# EAGLE board ferminator2000 (EAGLE 6.2)
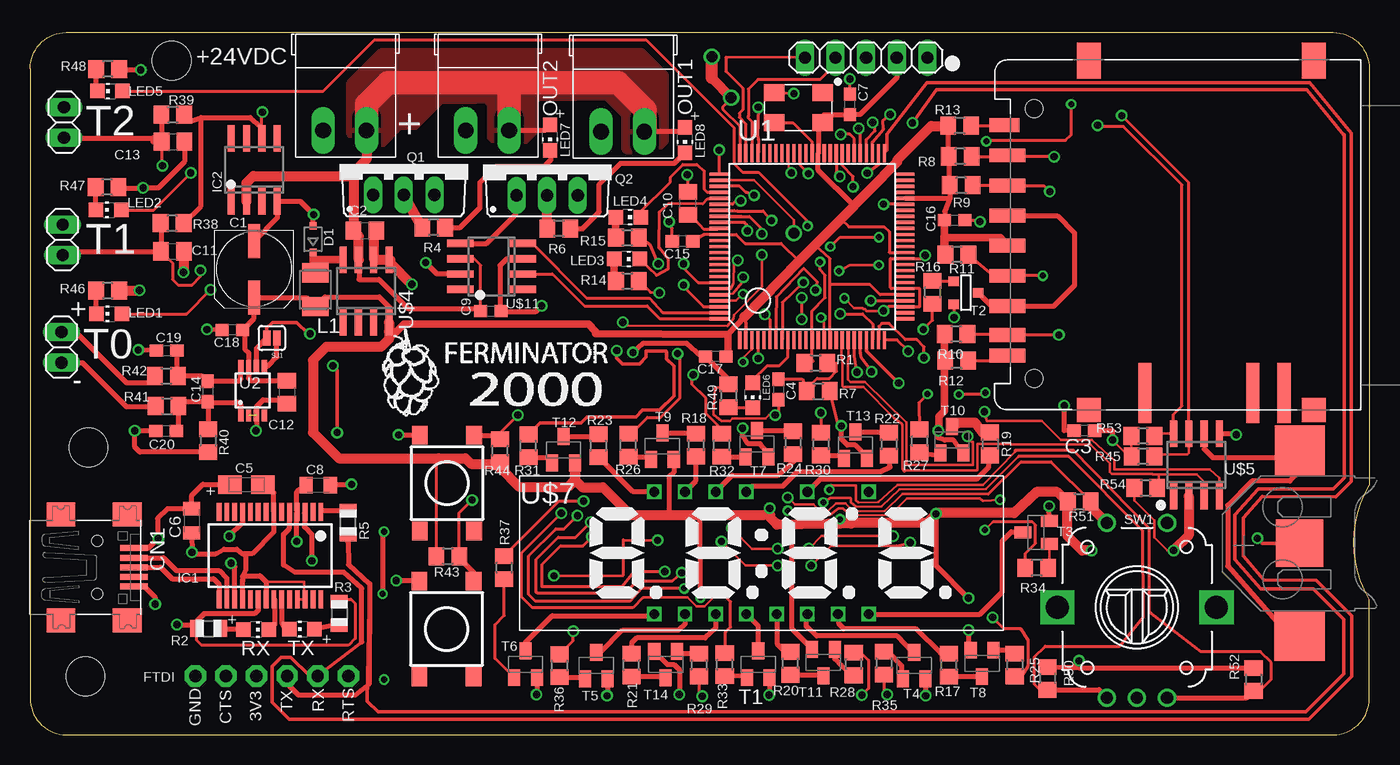
[diagram p4: board, top side]
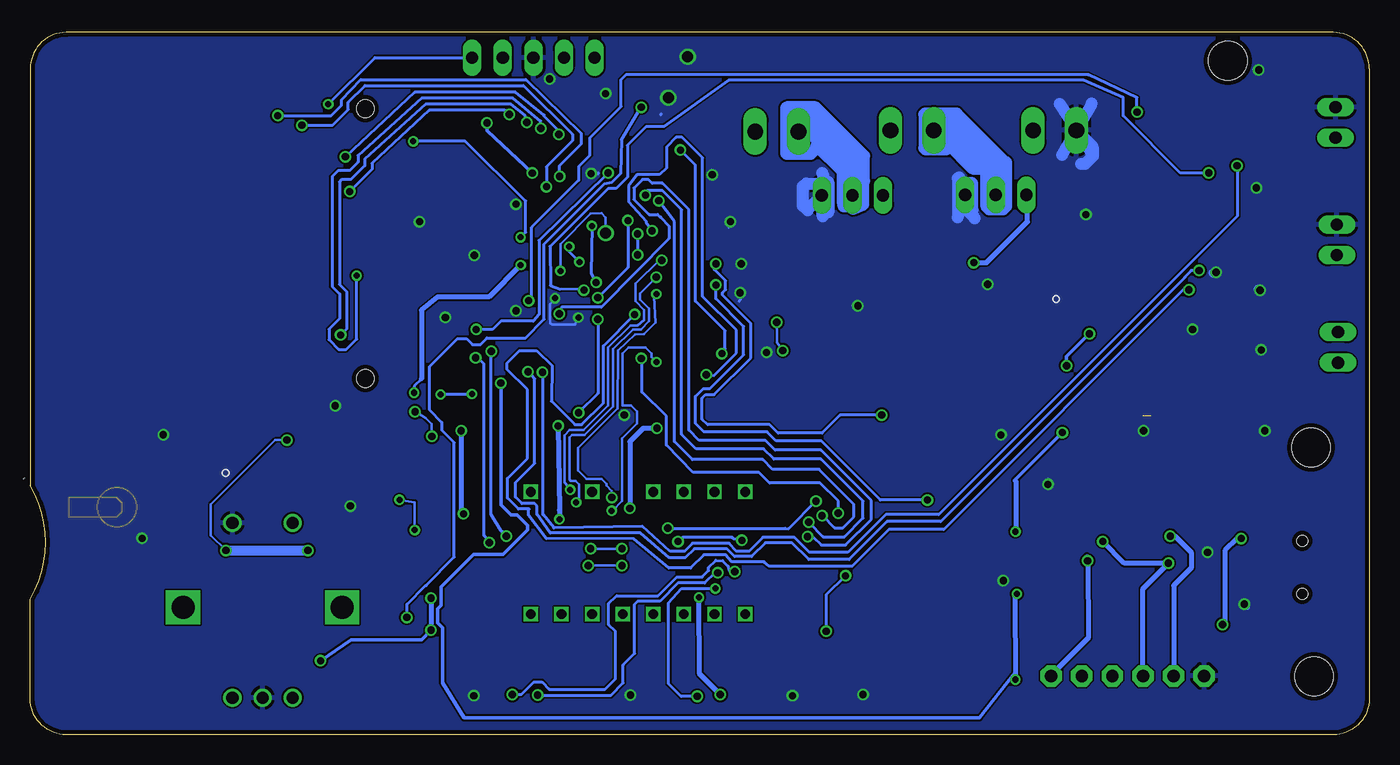
[diagram p5: board, bottom side, seen from below]

Size 111.15 x 58.3 mm. Coordinates in mm from the lower left corner, seen from the top.
Outline: 0,55.3 0,3 arc90 3,0 108.15,0 arc90 111.15,3 111.15,11.25 arc-61 111.15,20.7 111.15,55.3 arc90 108.15,58.3 3,58.3 arc90 0,55.3
Copper layers (1*16): Top 0.0356mm / dielectric 1.5011mm / Bottom 0.0356mm
Design rules: minimum track width 6mil, minimum drill 13mil, track to track 6mil, track to pad 6mil, pad to pad 6mil, via to via 6mil, smd to smd 6mil, copper to edge 15mil, drill to drill 6mil, minimum pad ring 7mil, minimum via ring 7mil, stop-mask expansion 4mil, vias tented up to drill 0mil, thermal gap 10mil
Holes 3.2 mm at 4.6,4.85 4.85,23.85 11.75,55.95

## Footprints (pad centres in the part's own frame; a part is rotated, then mirrored left to right if it is on the bottom)
UD-6,3X5,8_NICHICON = smd 2.8 x 1: + 2.35,0; - -2.35,0
C0805 = smd 1.3 x 1.5: 1 -0.95,0; 2 0.95,0
C0603 = smd 1.1 x 1: 1 -0.85,0; 2 0.85,0
A/3216-18R = smd 1.95 x 1.5: + 1.375,0; - -1.375,0
C0805K = smd 1.1 x 1.4: 1 -1,0; 2 1,0
USB-MINIB = smd 0.5 x 2.308: D+ 0,4.064; D- -0.8,4.064; GND 1.6,4.064; ID 0.8,4.064; VBUS -1.6,4.064 | smd 2 x 2.4: GND1 -4.4,-2; GND2 -4.4,3.5; GND3 4.4,3.5; GND4 4.4,-2 | hole 0.9: -2.2,1; 2.2,1
NEARLAB_DM1AA-SF-PEJ = smd 1.15 x 3: 1 6.225,14.25; 2 3.725,14.25; 3 1.225,14.25; 4 -1.275,14.25; 5 -3.775,14.25; 6 -6.275,14.25; 7 -8.7,14.25; 8 -10.4,14.25 | smd 1.15 x 2.5: 9 8.725,14.5 | smd 2 x 2: P$10 -14.9,7.5; P$12 -14.9,-11.15 | smd 3 x 2: P$11 14.1,7.5; P$13 14.1,-11.15 | smd 5 x 1.1: P$14 -13.5,2.85; P$15 -13.5,-6.1; P$16 -13.5,-8.7 | hole 1.45: 10.1,12.05; -12.3,12.05
1X05 = drill 1.016 long: 1 -5.08,0; 2 -2.54,0; 3 0,0; 4 2.54,0; 5 5.08,0
SOD323-R = smd 0.6 x 0.6: A 1.1,0; C -1.1,0
1X06-CLEANBIG = drill 1.016 pad 1.778 octagon: 1 -6.35,0; 2 -3.81,0; 3 -1.27,0; 4 1.27,0; 5 3.81,0; 6 6.35,0
SSOP28 = smd 0.4 x 1.5: 1 -4.225,-3.625; 2 -3.575,-3.625; 3 -2.925,-3.625; 4 -2.275,-3.625; 5 -1.625,-3.625; 6 -0.975,-3.625; 7 -0.325,-3.625; 8 0.325,-3.625; 9 0.975,-3.625; 10 1.625,-3.625; 11 2.275,-3.625; 12 2.925,-3.625; 13 3.575,-3.625; 14 4.225,-3.625; 15 4.225,3.625; 16 3.575,3.625; 17 2.925,3.625; 18 2.275,3.625; 19 1.625,3.625; 20 0.975,3.625; 21 0.325,3.625; 22 -0.325,3.625; 23 -0.975,3.625; 24 -1.625,3.625; 25 -2.275,3.625; 26 -2.925,3.625; 27 -3.575,3.625; 28 -4.225,3.625
SO08 = smd 0.6 x 2.2: 1 -1.905,-2.6; 2 -0.635,-2.6; 3 0.635,-2.6; 4 1.905,-2.6; 5 1.905,2.6; 6 0.635,2.6; 7 -0.635,2.6; 8 -1.905,2.6
L3225M = smd 1.6 x 2.2: 1 -1.4,0; 2 1.4,0
CHIP-LED0805 = smd 1.2 x 1.2: A 0,-1.05; C 0,1.05
TO220BV = drill 1.016 long: D 0,-2.54; G -2.54,-2.54; S 2.54,-2.54
R0805 = smd 1.3 x 1.5: 1 -0.95,0; 2 0.95,0
R0805' = smd 1.1 x 1.4: 1 -1,0; 2 1,0
TACTILE_SWITCH_TALL = smd 1.55 x 1.3: A1 -3.975,-2.25; A2 3.975,-2.25; B1 -3.975,2.25; B2 3.975,2.25
SJ_2S = smd 0.635 x 1.27: 1 -0.412,0; 2 0.412,0
PEC12_INCREMENTAL_ENCODER = drill 1: A -2.5,-7.5; B 2.5,-7.5; C 0,-7.5; P1 -2.5,7; P2 2.5,7 | drill 1.9 square: GND@1 -6.6,0; GND@2 6.6,0
SOT23-BEC = smd 1 x 1.4: B -0.95,-1.1; C 0,1.1; E 0.95,-1.1
SOT-23 = smd 0.787 x 0.889: 1 0.025,-1.016; 2 -0.94,1.016; 3 0.991,1.016
1X02 = drill 1.016 long: 1 -1.27,0; 2 1.27,0
TQFP100 = smd 0.27 x 1.5: 1 -6,-7.75; 2 -5.5,-7.75; 3 -5,-7.75; 4 -4.5,-7.75; 5 -4,-7.75; 6 -3.5,-7.75; 7 -3,-7.75; 8 -2.5,-7.75; 9 -2,-7.75; 10 -1.5,-7.75; 11 -1,-7.75; 12 -0.5,-7.75; 13 0,-7.75; 14 0.5,-7.75; 15 1,-7.75; 16 1.5,-7.75; 17 2,-7.75; 18 2.5,-7.75; 19 3,-7.75; 20 3.5,-7.75; 21 4,-7.75; 22 4.5,-7.75; 23 5,-7.75; 24 5.5,-7.75; 25 6,-7.75; 51 6,7.75; 52 5.5,7.75; 53 5,7.75; 54 4.5,7.75; 55 4,7.75; 56 3.5,7.75; 57 3,7.75; 58 2.5,7.75; 59 2,7.75; 60 1.5,7.75; 61 1,7.75; 62 0.5,7.75; 63 0,7.75; 64 -0.5,7.75; 65 -1,7.75; 66 -1.5,7.75; 67 -2,7.75; 68 -2.5,7.75; 69 -3,7.75; 70 -3.5,7.75; 71 -4,7.75; 72 -4.5,7.75; 73 -5,7.75; 74 -5.5,7.75; 75 -6,7.75 | smd 1.5 x 0.27: 26 7.75,-6; 27 7.75,-5.5; 28 7.75,-5; 29 7.75,-4.5; 30 7.75,-4; 31 7.75,-3.5; 32 7.75,-3; 33 7.75,-2.5; 34 7.75,-2; 35 7.75,-1.5; 36 7.75,-1; 37 7.75,-0.5; 38 7.75,0; 39 7.75,0.5; 40 7.75,1; 41 7.75,1.5; 42 7.75,2; 43 7.75,2.5; 44 7.75,3; 45 7.75,3.5; 46 7.75,4; 47 7.75,4.5; 48 7.75,5; 49 7.75,5.5; 50 7.75,6; 76 -7.75,6; 77 -7.75,5.5; 78 -7.75,5; 79 -7.75,4.5; 80 -7.75,4; 81 -7.75,3.5; 82 -7.75,3; 83 -7.75,2.5; 84 -7.75,2; 85 -7.75,1.5; 86 -7.75,1; 87 -7.75,0.5; 88 -7.75,0; 89 -7.75,-0.5; 90 -7.75,-1; 91 -7.75,-1.5; 92 -7.75,-2; 93 -7.75,-2.5; 94 -7.75,-3; 95 -7.75,-3.5; 96 -7.75,-4; 97 -7.75,-4.5; 98 -7.75,-5; 99 -7.75,-5.5; 100 -7.75,-6
MSOP8 = smd 0.45 x 1: 1 -0.975,-2.05; 2 -0.325,-2.05; 3 0.325,-2.05; 4 0.975,-2.05; 5 0.975,2.05; 6 0.325,2.05; 7 -0.325,2.05; 8 -0.975,2.05
CRYSTAL = smd 1.7 x 1.4: P$1 0.8,0.65; P$2 4.8,0.65; P$3 4.8,3.15; P$4 0.8,3.15
12.5MMCOILCELLHOLDER = smd 3.96 x 3.96: P$1 0,0 | smd 4.17 x 4.17: P$2 -7.69,0.02; P$3 7.66,0
PHOENIX_3.5MM = drill 1.3 long: P$1 0,0; P$2 0,3.6
SOIC8 = smd 0.6 x 2.2: 1 -1.905,-2.6; 2 -0.635,-2.6; 3 0.635,-2.6; 4 1.905,-2.6; 5 1.905,2.6; 6 0.635,2.6; 7 -0.635,2.6; 8 -1.905,2.6
LTC-4727JR = drill 0.8 square: 1 -8.89,-5.08; 2 -6.35,-5.08; 3 -3.81,-5.08; 4 -1.27,-5.08; 5 1.27,-5.08; 6 3.81,-5.08; 7 6.35,-5.08; 8 8.89,-5.08; 9 8.89,5.08; 11 3.81,5.08; 13 -1.27,5.08; 14 -3.81,5.08; 15 -6.35,5.08; 16 -8.89,5.08

## Placement (x,y rotation side)
C1  100u  [UD-6,3X5,8_NICHICON]  18.58,38.64 270 top
C2  1u  [C0805]  27.78,41.84 0 top
C3  .1u  [C0603]  87.5,25.24 180 top
C4  .1u  [C0603]  62.11,28.67 270 top
C5  10uF  [A/3216-18R]  17.96,20.76 180 top
C6  0.1uF  [C0805K]  13.41,17.76 270 top
C7  .1u  [C0603]  68.05,52.33 90 top
C8  0.1uF  [C0805K]  23.91,20.72 0 top
C9  .1u  [C0603]  38.24,35.17 0 top
C10  10uF  [C0805]  54.59,44.12 90 top
C11  10uF  [C0805]  11.81,40.13 0 top
C12  10u  [C0805]  21.31,28.44 270 top
C13  10uF  [C0805]  11.87,49.22 0 top
C14  10u  [C0603]  14.72,28.5 270 top
C15  .1u  [C0603]  54.14,40.96 180 top
C16  .1u  [C0603]  76.74,42.72 0 top
C17  .1u  [C0603]  56.9,31.41 180 top
C18  .1u  [C0603]  16.78,33.61 180 top
C19  10u  [C0603]  11.34,31.88 0 top
C20  10u  [C0603]  11.3,25.2 180 top
CN1  MINIB  [USB-MINIB]  4.56,13.9 270 top
CONN2  NEARLAB_SDCARD_HOLDER  [NEARLAB_DM1AA-SF-PEJ]  95.37,41.87 90 top
CPU  [1X05]  69.38,56.21 180 top
D1  [SOD323-R]  23.48,41.14 90 top
FTDI  [1X06-CLEANBIG]  20.06,4.88 0 top
IC1  FT232RL  [SSOP28]  19.91,14.88 180 top
IC2  REF01D  [SO08]  18.6,46.89 0 top
L1  [L3225M]  23.68,36.94 270 top
LED1  [CHIP-LED0805]  6.57,34.94 90 top
LED2  [CHIP-LED0805]  6.52,43.57 90 top
LED3  [CHIP-LED0805]  49.54,39.49 270 top
LED4  [CHIP-LED0805]  49.64,42.97 270 top
LED5  [CHIP-LED0805]  6.62,53.43 90 top
LED6  [CHIP-LED0805]  59.97,28.18 180 top
LED7  Red  [CHIP-LED0805]  43.15,49.56 180 top
LED8  Red  [CHIP-LED0805]  54.35,49.36 180 top
Q1  STP5NA50  [TO220BV]  31.01,47.35 0 top
Q2  STP5NA50  [TO220BV]  42.91,47.32 0 top
R1  470  [R0805]  65.21,30.86 0 top
R2  1k  [R0805']  14.82,8.82 0 top
R3  1k  [R0805']  25.66,10.08 270 top
R4  5.6k  [R0805]  33.49,42.11 180 top
R5  10  [R0805']  26.4,17.62 90 top
R6  5.6k  [R0805]  43.87,42.01 180 top
R7  10k  [R0805]  65.41,28.52 0 top
R8  10k  [R0805]  77.19,48.01 180 top
R9  10k  [R0805]  77.27,45.61 180 top
R10  10k  [R0805]  76.84,33.26 180 top
R11  10k  [R0805]  76.92,39.86 180 top
R12  10k  [R0805]  76.89,31.06 180 top
R13  10k  [R0805]  77.14,50.56 180 top
R14  1k  [R0805]  49.57,37.67 0 top
R15  1k  [R0805]  49.57,41.27 0 top
R16  22  [R0805]  74.9,36.73 90 top
R17  100  [R0805]  76.25,5.79 90 top
R18  100  [R0805]  55.26,24.05 270 top
R19  100  [R0805]  79.67,24.14 270 top
R20  100  [R0805]  63.1,5.93 90 top
R21  100  [R0805]  49.9,5.78 90 top
R22  100  [R0805]  71.27,24.11 270 top
R23  100  [R0805]  47.16,24 270 top
R24  100  [R0805]  63.31,24.25 270 top
R25  2.7k  [R0805]  81.71,5.8 270 top
R26  2.7k  [R0805]  49.65,24.03 90 top
R27  2.7k  [R0805]  73.82,24.39 90 top
R28  2.7k  [R0805]  68.35,5.88 90 top
R29  2.7k  [R0805]  55.51,5.8 270 top
R30  2.7k  [R0805]  65.65,24.13 90 top
R31  2.7k  [R0805]  41.35,23.98 90 top
R32  2.7k  [R0805]  57.4,24.03 90 top
R33  1k  [R0805]  57.65,5.83 90 top
R34  1k  [R0805]  83.54,13.86 180 top
R35  1k  [R0805]  70.86,5.95 270 top
R36  1k  [R0805]  43.95,5.73 90 top
R37  1k  [R0805]  39.35,13.88 90 top
R38  10k  [R0805]  11.79,42.46 180 top
R39  10k  [R0805]  11.84,51.46 180 top
R40  1MEG  [R0805]  14.77,24.41 270 top
R41  10k  [R0805]  11.37,27.28 0 top
R42  10k  [R0805]  11.32,29.78 0 top
R43  10k  [R0805]  34.67,14.82 0 top
R44  10k  [R0805]  39,23.58 90 top
R45  10k  [R0805]  92.36,23.11 180 top
R46  1k  [R0805]  6.44,36.86 180 top
R47  1k  [R0805]  6.39,45.46 180 top
R48  1k  [R0805]  6.44,55.26 180 top
R49  1k  [R0805]  57.96,28.15 270 top
R50  10k  [R0805]  84.42,4.68 270 top
R51  10k  [R0805]  87.07,19.37 0 top
R52  10k  [R0805]  101.54,4.59 270 top
R53  10k  [R0805]  92.35,24.81 180 top
R54  10k  [R0805]  92.59,20.48 180 top
RX  Green  [CHIP-LED0805]  18.77,8.73 270 top
S2  SWITCH-MOMENTARY-2  [TACTILE_SWITCH_TALL]  34.6,20.88 90 top
S3  SWITCH-MOMENTARY-2  [TACTILE_SWITCH_TALL]  34.56,8.78 90 top
SJ1  SOLDERJUMPERNC  [SJ_2S]  20.06,32.93 180 top
SW1  ENCODER_SW1-PEC12  [PEC12_INCREMENTAL_ENCODER]  91.86,10.58 0 top
T1  [SOT23-BEC]  60.43,5.85 0 top
T2  [SOT-23]  77.66,36.67 90 top
T3  [SOT23-BEC]  83.48,16.8 90 top
T4  [SOT23-BEC]  73.37,5.75 0 top
T5  [SOT23-BEC]  46.99,5.75 0 top
T6  [SOT23-BEC]  41.11,5.85 0 top
T7  [SOT23-BEC]  60.33,24.15 0 top
T8  [SOT23-BEC]  79.01,5.93 180 top
T9  [SOT23-BEC]  52.47,23.95 0 top
T10  [SOT23-BEC]  76.51,24.48 0 top
T11  [SOT23-BEC]  65.83,6 180 top
T12  [SOT23-BEC]  44.27,23.65 0 top
T13  [SOT23-BEC]  68.49,24.05 0 top
T14  [SOT23-BEC]  52.75,5.83 180 top
THERM0  [1X02]  2.6,32.16 270 top
THERM1  [1X02]  2.7,41.08 270 top
THERM2  [1X02]  2.8,50.83 270 top
TX  Red  [CHIP-LED0805]  22.55,8.77 90 top
U1  DSPIC33FJ256GP510A  [TQFP100]  64.9,40.53 0 top
U2  AD8495  [MSOP8]  18.46,28.57 0 top
U$1  FOX924  [CRYSTAL]  66.56,53.95 180 top
U$2  12MM_BATTER_HOLDER  [12.5MMCOILCELLHOLDER]  105.35,15.9 270 top
U$3  PHOENIX-3.5MM  [PHOENIX_3.5MM]  27.92,50.17 90 top
U$4  LM2594  [SOIC8]  27.88,36.84 0 top
U$5  DS3231  [SOIC8]  96.8,22.4 0 top
U$7  LTC-4027JRLTC-4027JR  [LTC-4727JR]  60.7,15.08 0 top
U$8  PHOENIX-3.5MM  [PHOENIX_3.5MM]  50.98,50.07 90 top
U$10  PHOENIX-3.5MM  [PHOENIX_3.5MM]  39.75,50.17 90 top
U$11  TC4427  [SOIC8]  38.31,38.88 90 top

## Tracks (layer width: path | path; a pad name or v marks a point on that pad's centre or on a via)
1
  Top 0.406: R17.1 T8.C
2
  Top 0.406: T9.C 55.26,25.05 R18.1
3
  Top 0.2: 79.09,25.05 R19.1
  Top 0.406: 79.56,25.15 R19.1
  Top 0.813: T10.C 77.11,25.91 78.43,25.91 79.09,25.05
4
  Top 0.406: R20.1 65.75,4.98 T11.C
5
  Top 0.406: R21.1 52.65,4.83 T14.C
6
  Top 0.406: T13.C 71.36,25.15 R22.1
7
  Top 0.406: T12.C 47.16,24.75 R23.1
8
  Top 0.406: T7.C 63.31,25.25 R24.1
+2.5VREF  (via drill 0.6)
  Top 0.254: IC2.6 19.23,51.65 v19.28,51.69 | v69.78,36.04 71.37,36.03 U1.29
  Top 0.406: R39.1 13.31,50.94 14.18,51.24 | 14.18,51.24 18.28,51.24 19.14,50.48 IC2.6 | R38.1 14.18,43.9 14.18,51.24
  Bottom 0.254: v19.28,51.69 19.28,52.89 23.33,54.79 61.7,54.79 62.1,54.39 62.1,52.15 64.7,49.55 64.7,48.1 65.63,47.17 65.63,46.04 69.53,42.14 69.53,36.29 v69.78,36.04
+3V3  (via drill 0.6)
  Top 0.406: IC1.17 16.98,13.93 v16.68,14.24 | v22.13,16.04 22.13,18.45 IC1.4 22.13,18.56 22.13,20.14 22.26,20.31 C8.1
  Bottom 0.406: v22.13,16.04 20.33,14.24 v16.68,14.24 18.79,12.13 FTDI.3
+5V  (via drill 0.6)
  Top 0.254: R3.1 25.82,11.24 26.63,11.24 26.98,10.89 26.98,7.99 26.43,7.44 14.23,7.44 13.82,7.85 R2.1
  Top 0.406: CN1.VBUS 9.84,15.5 v10.63,16.29 10.58,16.34 10.58,17.94 11.4,18.76 C6.1 13.41,19.87 14.33,20.79 16.55,20.79 C5.+ | v12.18,9.14 13.74,9.14 R2.1 13.82,9.43 14.43,10.04 18.63,10.04 18.93,10.34 IC1.20
  Bottom 0.406: v10.63,16.29 10.98,16.29 11.98,15.29 11.98,9.34 v12.18,9.14
+24V
  Top 0.254: C9.1 37.39,38.98 36.88,39.49 35.73,39.49 U$11.6
  Top 0.406: U$4.7 27.28,39.44 27.3,39.44 27.3,37.8 28.95,37.8 31.35,35.4 37.16,35.4 C9.1 | U$10.P$1 42.71,50.17 LED7.A | 51.03,50.12 54.06,50.12 LED8.A | 26.73,46.39 26.83,46.49
  Top 0.813: 27.28,39.44 27.28,41.39 C2.1 26.83,46.49 26.83,46.69 27.92,47.78 U$3.P$1 | IC2.2 17.96,45.83 18.53,46.39 26.73,46.39
  Top 1.93: U$3.P$1 27.92,52.33 29.73,54.14 39.73,54.14 | 39.73,54.14 48.78,54.14 51.03,51.89 51.03,50.12 U$8.P$1 | U$10.P$1 39.75,54.12 39.73,54.14
  pour Top: 26.4,51.12 26.4,49.92 27.36,48.96 29.3,48.96 30.76,50.42 32,50.42 34.16,52.58 36.94,52.58 36.98,52.62 37.81,52.62 38.1,52.33 38.1,49.55 39.02,48.63 40.51,48.63 41.92,50.04 41.92,52.54 42.21,52.83 45.24,52.83 45.28,52.87 47.81,52.87 49.26,51.42 49.26,51 49.26,48.63 49.47,48.42 51.96,48.42 52.83,49.29 52.83,54.74 50.8,56.77 29.09,56.77 26.4,54.08 26.4,51.29
AA1  (via drill 0.6)
  Top 0.254: R32.2 57.4,25.37 56.08,26.69 56.08,27.94 54.93,29.09 54.93,29.79 v55.03,29.89 | v59.53,41.84 59.53,42.29 59.29,42.53 U1.84
  Bottom 0.254: v55.03,29.89 54.38,29.84 52.53,31.69 52.53,33.59 55.33,36.39 55.33,47.89 57.03,49.59 57.53,49.59 58.33,48.79 58.33,47.04 58.93,46.51 60.78,46.51 61.48,45.54 61.47,44.25 60.03,42.64 60.03,42.54 v59.53,41.84
AA1_BASE
  Top 0.406: R32.1 59.38,23.08 T7.B
AB2  (via drill 0.6)
  Top 0.2: v60.73,39.84 60.73,37.19 58.43,34.84 58.38,34.54 57.88,33.94 49.63,33.99 49.43,33.99 v49.18,34.24 | 41.38,24.96 R31.2
  Top 0.254: 59.08,43.04 57.24,43.04 U1.83 59.69,43.03 60.73,41.99 v60.73,41.59
  Top 0.305: 41.38,24.96 42.31,25.89 45.73,25.89 46.23,26.39 50.28,26.39 50.83,26.94 52.23,26.94 53.43,28.14 53.43,30.59 52.83,31.19 52.83,31.79 52.78,31.84 51.13,31.84 51.13,31.34 50.58,30.79 49.18,30.79 48.68,31.29 v48.68,31.89
  Bottom 0.2: v49.18,34.24 49.18,32.54 v48.68,31.89
  Bottom 0.254: v60.73,41.59 v60.73,39.84
AB2_BASE
  Top 0.406: R31.1 43.32,23.03 T12.B
AC3  (via drill 0.6)
  Top 0.254: U1.82 58.44,43.53 58.68,43.49 60.83,43.49 v61.53,42.69 | v64.03,36.29 v64.03,34.49 | v65.63,26.74 65.63,25.1 R30.2
  Bottom 0.254: v61.53,42.69 61.53,38.79 v64.03,36.29 | v64.03,34.49 64.03,28.34 v65.63,26.74
AC3_BASE
  Top 0.406: R30.1 67.54,23.18 T13.B
AD  (via drill 0.5, 0.6)
  Top 0.254: R29.2 55.51,3.46 v55.78,3.19 | v54.28,12.14 50.73,12.14 49.78,11.09 41.93,11.09 41.38,11.64 41.38,14.84 43.63,17.09 44.33,17.09 v45.43,18.19 | v58.98,44.34 58.59,44.34 58.3,44.05 U1.81
  Bottom 0.254: v55.78,3.19 57.13,3.19 58.18,4.24 58.18,10.94 57.08,12.14 v54.28,12.14 | v45.43,18.19 45.38,18.19 44.38,17.19 43.68,17.19 42.78,18.09 42.78,19.14 45.68,22.04 49.53,22.04 50.33,22.84 56.18,22.84 57.68,24.34 57.68,42.59 v58.98,44.34
AD_BASE
  Top 0.406: T14.B 53.88,6.75 R29.1
ADP  (via drill 0.6)
  Top 0.254: R25.2 82.29,4.85 82.83,5.74 82.83,7.84 82.23,8.79 80.83,8.79 v79.88,9.74 | v60.43,52.09 60.36,49.69 60.43,49.39 60.43,48.31 U1.72
  Bottom 0.254: v79.88,9.74 79.88,10.84 78.33,12.39 78.28,12.39 75.96,14.75 75.96,24.25 76.98,25.29 76.98,25.94 78.03,26.99 78.03,30.54 75.68,32.89 74.93,32.89 74.43,32.39 73.78,32.39 73.23,32.94 70.03,32.94 68.48,34.49 68.48,40.74 63.53,45.69 62.88,45.84 62.13,46.59 62.08,49.39 v60.43,52.09
ADP_BASE
  Top 0.406: T8.B 81.43,7.03 R25.1
AE  (via drill 0.6)
  Top 0.254: R28.2 68.45,6.86 68.48,6.89 68.88,6.89 69.58,6.19 69.58,3.84 v69.03,3.29 | v54.08,13.44 53.28,12.74 50.28,12.74 49.48,11.74 42.08,11.74 41.98,11.84 41.98,14.54 43.83,16.39 45.28,16.39 v46.53,17.64 | v60.08,44.79 59.38,45.04 58.88,45.54 U1.78
  Bottom 0.254: v69.03,3.29 62.93,3.29 61.93,4.29 61.93,5.79 60.98,6.74 60.98,10.84 60.73,11.09 58.88,11.09 57.38,12.59 55.18,12.59 54.33,13.44 v54.08,13.44 | v46.53,17.64 45.33,16.44 43.58,16.44 42.03,17.99 42.03,19.39 45.53,22.89 49.43,22.89 50.28,23.74 55.88,23.74 57.08,24.94 57.08,43.59 58.68,45.19 59.93,45.19 v60.08,44.79
AE_BASE
  Top 0.406: T11.B 66.78,6.29 67.38,5.69 R28.1
AF  (via drill 0.5, 0.9)
  Top 0.2: U1.77 60.08,46.04 63.38,42.74 v63.38,41.64 | v67.14,38.51 68.03,38.99 v70.43,38.99
  Top 0.254: v79.28,28.39 79.13,28.24 v77.08,28.24 | v74.48,28.29 73.75,27.56 R27.2
  Bottom 0.2: v63.38,41.64 63.38,42.94 63.73,43.29 64.65,43.27 67.14,40.75 v67.14,38.51 | v70.43,38.99 70.38,39.04
  Bottom 0.254: 78.68,29.54 79.28,28.94 v79.28,28.39 | v77.08,28.24 77.03,28.29 v74.48,28.29
  Bottom 0.406: 70.33,39.09 v70.43,38.99 73.08,36.34 77.33,36.34 78.68,35.24 78.68,29.54
AF_BASE
  Top 0.406: R27.1 75.6,23.13 T10.B
AG  (via drill 0.6)
  Top 0.254: R26.2 49.87,24.98 51.23,26.34 52.33,26.34 53.93,27.94 53.93,31.29 v53.73,31.64 | v57.18,48.54 57.18,46.56 U1.76
  Bottom 0.254: v53.73,31.64 53.73,31.79 53.48,32.04 53.48,33.54 55.93,35.99 55.93,47.29 v57.18,48.54
AG_BASE
  Top 0.406: R26.1 51.52,23.08 T9.B
CLKIN
  Top 0.254: U$1.P$3 63.32,50.8 64.88,49.24 64.88,48.3 U1.63
CS1  (via drill 0.6)
  Top 0.254: R8.1 81.03,48.01 CONN2.1 81.22,47.99 v84.98,47.99 | U1.56 68.4,49.47 68.03,49.84 v67.28,49.84
  Bottom 0.254: v67.28,49.84 67.28,50.14 68.48,51.34 68.48,51.44 70.88,53.34 79.23,53.34 v84.98,47.99
CTS  (via drill 0.6)
  Top 0.406: IC1.11 17.64,17.59 v16.53,16.49
  Bottom 0.406: v16.53,16.49 16.13,16.49 14.78,15.14 14.78,13.84 16.23,12.39 16.23,4.9 FTDI.2
GATE
  Top 0.254: R16.2 74.92,37.66 T2.3
GND  (via drill 0.5, 0.6, 0.9)  (1 unrouted)
  Top 0.2: R49.1 57.7,28.84 56.83,28.84 56.73,26.59 57.38,26.04 58.08,26.04 58.28,26.24 61.03,26.24 61.33,26.54 v61.83,26.54 | U1.15 65.88,32.8 65.88,34.24 65.53,34.64 v65.65,34.64 | v67.58,36.24 68.38,35.44 69.08,35.44 69.18,35.34 69.28,35.34 69.43,35.19 v70.83,35.19 | IC1.25 IC1.26 22.73,11.36 22.73,12.69 19.58,12.69
  Top 0.254: C15.2 53.29,42.03 v53.03,42.59 | C10.2 54.59,46.58 v54.53,46.49 | U1.65 63.9,47.27 v64.59,46.59 | C7.2 68.05,53.27 v68.03,54.44 | R15.2 51.4,40.72 v52.13,39.09 | C4.2 62.11,26.82 v61.83,26.54 | U1.45 v70.84,44.03 v70.83,44.04 | C16.2 78.5,42.72 v78.83,42.59 | v70.83,35.19 70.88,35.19 71.23,35.54 U1.28 73.83,35.54 73.83,37.04 73.82,37.03 U1.31 71.48,37.04 71.38,37.14 71.38,39.49 71.42,39.53 U1.36 74.08,39.54 74.28,39.74 v74.28,39.79 | T2.2 76.68,35.69 v76.68,34.64 | 61.72,53.34 U$1.P$2 v63.39,53.22 | R14.2 50.66,37.57 51.48,36.74 52.18,36.64 v52.23,36.69 | R49.1 57.96,29.5 | C17.2 55.66,31.41 | 58.93,48.31 U1.75 58.91,50.51 57.47,51.95 57.47,52.11 58.23,52.87 58.23,52.89 v58.18,52.89 | C9.2 39.09,38.85 39.68,39.44 40.83,39.44 U$11.3
  Top 0.305: U$2.P$1 102.25,15.9 v101.85,16.3
  Top 0.406: 28.52,41.62 C2.2 | C20.2 8.72,25.2 v8.68,25.24 8.68,23.89 9.11,23.46 R40.2 | C19.1 v8.98,31.94 | C18.2 v14.68,33.64 | R48.1 7.46,55.19 v9.18,55.19 | R47.1 7.34,45.39 v9.38,45.39 10.63,45.39 12.82,47.58 C13.2 | C12.2 21.01,27.79 19.33,27.79 18.79,27.25 U2.3 18.79,25.29 v18.73,25.24 | C6.2 13.46,15.02 | CN1.GND 9.47,12.3 10.38,11.39 v10.38,10.84 | 13.53,15.24 13.46,15.02 | 13.46,15.02 v13.43,15.14 | 13.46,15.02 15.41,15.02 16.08,15.39 17.18,15.39 17.64,15.03 | 17.64,15.03 17.88,14.84 17.88,13.64 17.63,13.14 17.63,12.74 | IC1.18 17.63,11.31 17.63,12.74 | 17.64,15.03 18.42,15.03 20.23,16.84 IC1.7 20.23,20.09 19.68,20.64 | 19.68,20.64 19.56,20.76 C5.- | 19.68,20.64 19.53,20.64 19.43,20.74 19.18,20.74 19.23,20.79 19.33,20.79 | C8.2 24.63,20.79 v26.68,20.79 | 17.63,12.74 17.68,13.19 19.08,13.19 19.58,12.69 19.58,11.31 IC1.21 | S2.B2 30.61,24.86 v30.58,24.89 | S3.B2 30.42,12.75 v30.38,12.79 | T6.E 42.06,3.12 v42.03,3.34 | T5.E 47.94,3.55 v47.88,3.24 | T1.E 61.38,3.49 v61.33,3.29 | T4.E 74.32,3.35 v74.33,3.24 | T3.E v84.57,18.98 v84.58,18.99 | U$4.5 29.88,39.44 | D1.A 23.48,43.14 v23.53,43.19 22.43,44.29 IC2.4 20.5,42.92 C1.- | 57.96,29.5 C17.2 | 55.66,31.41 54.48,32.49 50.88,32.49 v50.03,31.74 | U$11.3 39.61,39.52 39.6,39.5 39.55,39.5 39,38.95 39,35.15 42,35.15 v42.45,35.6 | U$5.5 100,25 v100.1,24.9 | C3.2 85.83,25.24 v85.83,27.32 | U$4.6 28.52,39.51 28.58,39.44 U$4.6
  Top 0.813: 28.58,39.44 U$4.5 | 28.52,41.62 28.52,39.51 | 29.88,39.44 29.88,39.19 v31.68,37.39 | C11.2 12.76,38.42 v12.73,38.39 | R46.1 9.05,36.86 v9.08,36.89 | 56.58,54.54 56.58,54.49 v58.18,52.89
  Top 1.016: 56.58,54.54 v56.58,56.29
  Bottom 0.2: v65.65,34.64 65.93,34.04 67.83,34.04 67.98,34.19 67.98,35.74 67.58,36.14 v67.58,36.24 | v56.58,56.29 56.78,56.29
  Bottom 0.254: v53.03,42.59 53.18,42.14 | v54.53,46.49 54.68,46.84 54.63,46.89 | 58.78,51.54 58.83,51.49 58.83,51.44 | v64.59,46.59 63.98,46.59 64,46.64 | v68.03,54.44 68.08,54.64 | v52.13,39.09 52.23,38.99 | 52.28,35.99 52.28,36.04 52.18,36.14 52.23,36.19 v52.23,36.69 | v61.83,26.54 61.58,26.29 | v70.83,44.04 70.78,44.04 70.68,43.94 | v78.83,42.59 78.98,42.44 | v70.83,35.19 70.73,35.19 | v74.28,39.79 74.18,39.79 | v76.68,34.64 76.63,34.69 76.58,34.69 | v50.03,31.74 49.88,31.59 | v58.18,52.89 58.28,52.99 58.38,52.99
  Bottom 0.305: v101.85,16.3 101.85,16.45 101.8,16.5
  Bottom 0.406: v8.68,25.24 8.48,25.34 | v8.98,31.94 8.78,31.94 | v14.68,33.64 14.68,33.84 | v9.18,55.19 9.23,55.24 9.53,55.24 | v9.38,45.39 9.38,45.69 9.33,45.69 | v18.73,25.24 18.88,25.24 18.93,25.19 | v13.43,15.14 13.13,15.14 | v10.38,10.84 10.38,10.79 10.13,10.54 | v26.68,20.79 26.68,21.14 | v30.58,24.89 30.38,25.09 | v30.38,12.79 30.38,12.99 30.43,13.04 | v42.03,3.34 41.88,3.39 | v61.33,3.29 61.13,3.44 | v74.33,3.24 74.18,3.34 | v84.58,18.99 84.63,18.99 84.68,19.04 | v31.68,37.39 31.68,37.69 | v23.53,43.19 23.73,43.19 23.78,43.24 | v42.45,35.6 42.8,35.6 | v100.1,24.9 100.1,24.85 100.25,24.7 | v85.83,27.32 85.54,27.32 85.54,27.21
  Bottom 0.813: v12.73,38.39 12.88,38.39 12.93,38.34 | v9.08,36.89 9.18,36.99
  Bottom 1.016: 32.74,42.87 34.06,44.19 34.06,46.29 34.17,46.18 34.17,42.97 | 32.93,43.58 32.96,43.61 32.96,45.77 33,45.81 33.52,45.81 33.52,45.27 | 45.41,46.64 45.35,46.58 45.35,43.41 | 45.35,43.41 45.35,43.04 45.38,43.07 45.38,44.83 46.63,43.58 46.63,43.54 47.01,43.92 47.01,45.52 46.76,45.77 45.47,45.77 45.47,44.86 | 45.02,45.91 44.91,45.89 44.91,43.35 44.97,43.41 45.35,43.41 | 23.05,52.39 25.52,48.15 | 25.69,52.35 22.92,48.06 23.61,47.37 23.91,47.37 | U$3.P$2 22.96,48.81 22.96,48.02 23.05,47.93
  pour Bottom: 110.98,58.24 -0.02,58.24 -0.02,0.24 110.98,0.24
HEATER1
  Top 0.2: U1.99 57.05,35.03 57.03,35.05
  Top 0.254: 57.03,35.05 52.5,35.05 51.4,36.25 46.2,36.25 41.65,40.8 40.92,40.8 U$11.4
HEATER2
  Top 0.2: U1.100 57.13,34.55
  Top 0.254: U$11.2 43.35,38.25 46,35.6 51.2,35.6 52.25,34.55 57.13,34.55
K1  (via drill 0.6)
  Top 0.2: v58.23,17.14 59.93,15.44 v62.03,15.44 | v64.63,15.44 65.68,16.49 v71.63,16.49
  Top 0.254: R37.2 43.91,19.39 v45.93,19.39 | v72.88,31.84 71.94,32.78 U1.25
  Bottom 0.2: v62.03,15.44 v64.63,15.44
  Bottom 0.254: v45.93,19.39 48.23,17.09 48.48,17.14 v58.23,17.14 | v72.88,31.84 72.88,18.29 72.08,16.94 71.63,16.69 v71.63,16.49
K2  (via drill 0.6)
  Top 0.2: v57.38,16.04 59.38,14.04 v62.03,14.04 | v64.83,14.04 66.48,15.69 71.93,15.69
  Top 0.254: R36.2 45.08,7.81 v45.08,8.59 | v74.18,31.29 74.18,32.19 73.58,32.79 72.63,32.79 71.28,34.14 70.68,34.14 70.43,33.89 70.43,32.81 U1.24 | v43.48,13.19 49.23,13.24 49.23,16.19 v52.08,16.14 | 71.93,15.69 v73.03,15.94
  Bottom 0.2: v62.03,14.04 v64.83,14.04
  Bottom 0.254: v74.18,31.29 73.98,31.29 73.48,30.79 73.48,16.54 v73.03,15.94 | v45.08,8.59 45.08,11.64 v43.48,13.19 | v52.08,16.14 52.73,16.24 52.88,16.39 56.98,16.39 v57.38,16.04
K3  (via drill 0.6)
  Top 0.254: R35.2 70.86,3.61 v71.13,3.34 | v52.68,13.54 50.13,13.54 49.13,12.29 42.48,12.29 42.48,14.14 44.03,15.69 45.88,15.69 v46.63,16.44 | v67.23,34.94 69.08,34.94 69.93,34.09 69.93,32.81 U1.23
  Bottom 0.254: v71.13,3.34 70.38,3.34 69.33,4.39 68.68,4.39 68.08,3.79 63.43,3.79 62.58,4.64 62.58,8.59 63.13,9.14 63.13,10.89 62.48,11.54 59.03,11.54 57.48,13.09 55.38,13.09 54.83,13.64 54.83,13.89 54.23,14.49 53.68,14.44 53.23,13.99 53.13,13.64 v52.68,13.54 | v46.63,16.44 46.18,16.44 45.48,15.74 43.48,15.74 41.33,17.89 41.33,19.44 45.53,23.64 49.33,23.64 50.13,24.44 55.63,24.44 56.48,25.29 56.48,43.59 58.68,45.79 59.53,45.79 59.83,46.09 60.33,46.09 61.03,45.39 61.03,44.44 59.78,43.19 59.08,43.19 58.88,42.99 58.83,42.99 58.13,42.24 58.13,41.19 63.74,35.49 67.03,35.49 v67.23,34.94
K3_BASE
  Top 0.406: R35.1 71.22,6.85 72.33,5.74 72.33,4.74 T4.B
K4  (via drill 0.5)
  Top 0.18: 68.07,18.24 71.38,18.25
  Top 0.2: U1.3 59.88,32.76 59.88,31.99 59.18,31.29 v59.18,30.94 | v62.88,18.59 63.33,18.19 66.38,18.24 67.08,18.79 67.48,18.79 68.07,18.24 | 71.38,18.25 72.78,19.61 78.83,19.61 79.08,19.39 v80.5,19.51 | v79.23,16.99 79.88,17.64
  Top 0.254: R34.2 82.59,15.04 83.45,15.9 83.45,17.4 83.2,17.65 79.89,17.65 79.88,17.64
  Bottom 0.2: v59.18,30.94 59.58,31.34 59.58,31.64 60.08,32.14 61.48,32.14 61.98,31.64 61.98,27.34 61.28,27.34 60.78,26.84 60.78,25.84 62.03,24.59 62.03,19.39 62.83,18.59 v62.88,18.59 | v80.5,19.51 79.23,19.29 v79.23,16.99
K4_BASE
  Top 0.2: T3.B 84.58,13.95 R34.1
  Top 0.406: 84.54,15.93 T3.B
K5  (via drill 0.6)
  Top 0.2: 50.88,11.39 54.56,11.39 55.3,10.65 55.95,10.65 56.7,11.4 57.77,11.4
  Top 0.254: R33.2 57.73,6.69 57.73,8.54 58.13,8.94 58.13,11.04 57.77,11.4 | 50.88,11.39 50.03,10.54 41.68,10.54 40.78,11.44 40.78,15.09 v44.08,18.39 | v60.43,31.24 60.43,32.75 U1.4
  Bottom 0.254: v44.08,18.39 44.08,19.39 45.58,20.89 49.78,20.89 50.68,21.79 56.13,21.79 58.35,24.05 58.35,26.45 60.38,28.44 60.38,31.19 v60.43,31.24
K5_BASE
  Top 0.406: R33.1 59.3,4.93 T1.B
MCLR1  (via drill 0.5)
  Top 0.254: R1.1 65.01,31.01 64.88,31.14 64.88,32.76 U1.13 64.9,35.18 65.97,36.29 65.97,38.16 65.57,38.6 v65.57,39.25 | v66.41,40.52 67.22,41.3 v70.45,41.3 | v79.35,49.26 79.43,49.34 85.93,49.34 86.4,49.81 v86.4,52.34
  Bottom 0.254: v65.57,39.25 66.58,40.26 v66.41,40.52 | v70.45,41.3 70.03,41.72 70.03,44.32 75.04,49.26 v79.35,49.26 | v86.4,52.34 82.53,56.21 CPU.1
N$1
  Top 0.254: R13.1 80.83,50.56 CONN2.9
N$2
  Top 0.254: R12.1 80.71,31.06 CONN2.8
N$3
  Top 0.61: LED3.A 48.44,37.55 R14.1
N$5
  Top 0.61: R15.1 48.57,41.69 LED4.A
N$6
  Top 0.254: R1.2 66.93,30.8 66.93,30.19 66.33,29.59 65.32,29.59 64.72,28.99 65.08,28.99 R7.1 64.08,29.52 C4.1
N$7
  Top 0.406: CN1.D+ 10.82,13.9 11.78,12.94 15.23,12.94 15.68,12.49 IC1.15
N$8
  Top 0.406: 82.43,35.59 81.95,35.59 | 81.95,35.59 CONN2.6 | CONN2.6 | CONN2.6 79.78,35.59 T2.1 | CONN2.3 85.23,43.1 86.68,41.65 86.68,37.3 84.94,35.56 81.98,35.56 81.95,35.59
N$9
  Top 0.406: CN1.D- 11.07,14.7 12.13,13.64 15.68,13.64 16.33,12.99 IC1.16
N$10
  Top 0.254: C10.1 54.79,43.18 55.88,41.99 57.09,41.99 U1.85
N$11
  Top 0.406: IC1.23 20.89,10.33 20.88,9.29 21.38,8.34 TX.C
N$12
  Top 0.254: LED4.C 50.59,43.35 53.13,45.89 53.13,46.29 54.18,47.34 55.33,47.34 55.93,46.79 55.93,45.29 56.18,45.04 U1.79
N$13
  Top 0.406: IC1.22 20.28,11.25 20.28,9.09 RX.C
N$14
  Top 0.406: RX.A 15.58,8.73 R2.2
N$15
  Top 0.2: 52.98,44.09 55.83,44.09
  Top 0.254: LED3.C 51.98,38.14 52.98,38.69 52.98,39.44 52.18,40.44 52.23,43.39 52.98,44.09 | 55.83,44.09 56.23,44.49 57.11,44.49 U1.80
N$16
  Top 0.406: TX.A 25.52,9.22 R3.2
N$17
  Top 0.406: IC1.1 24.25,18.62 R5.2
N$18
  Top 0.813: Q1.D R4.2
  Bottom 1.016: 31.01,46.92 31.09,47 32.93,47 34.94,49.01 34.94,48.77 35.11,48.6 36.82,48.6 36.94,48.72 36.94,51.48 36.86,51.56 34.27,51.56 30.23,47.52 30.15,47.52 | 30.18,47.55 30.15,47.52 | 30.15,47.52 30.15,43.86 30.4,43.61 31.55,43.61 31.77,43.83 31.77,46.57
  Bottom 1.778: Q1.D 31.01,46.92 34.28,50.19 36.13,50.19 U$10.P$2
N$19
  Top 0.406: T1.C 60.43,9 U$7.4
N$20  (via drill 0.6)
  Top 0.406: U$11.7 33.77,38.25 v32.83,39.19
  Bottom 0.406: v32.83,39.19 31.78,39.19 28.38,42.59 28.38,44.72 Q1.G
N$21
  Top 0.406: U$11.5 37.88,40.79 40.33,43.24 40.33,44.74 Q2.G
N$22
  Top 0.305: U$5.6 97.44,23.71
  Top 0.406: 97.44,23.71 98.15,23 104.78,23 U$2.P$2 105.37,21.87 104.55,21.05 101.4,21.05 99.4,19.05 99.4,14 104.6,8.1 104.84,8.75 U$2.P$3
N$23  (via drill 0.6)
  Top 0.2: R45.1 93.48,23.28 96.06,23.28 96.16,23.38 U$5.7
  Top 0.254: U1.59 66.9,46.7 v67.2,46.35 | U$5.7 96.16,45.84 v90.6,51.4
  Bottom 0.254: v67.2,46.35 67.2,47.25 65.4,49.05 65.4,49.9 70,54.4 83.7,54.4 85.3,52.7 85.3,52.25 86.15,51.4 v90.6,51.4
N$24
  Top 0.406: R4.1 35.7,42.11 37.33,43.74 37.33,45.84 38.68,47.19 42.68,47.19 43.23,47.74 43.23,48.43 LED7.C
N$25
  Top 0.813: R6.2 Q2.D
  Bottom 1.016: 42.79,43.68 42.01,44.02 42.01,45.92 41.94,45.99 41.94,48.06 45.97,52.09 48.36,52.09 48.4,52.05 48.4,48.28 48.36,48.24 46.35,48.24 45.88,48.71 45.88,48.96 43.71,46.79 | 43.71,46.79 43.52,43.86 43.64,43.88 43.45,44.25 | 43.71,46.79 43.47,47.03 42.91,47.03 | 42.85,43.65 43.45,44.25 | 43.45,44.25 43.58,43.93 43.65,43.99 43.69,44.08 43.69,48.68 46.44,51.38 46.44,51.53
  Bottom 1.778: Q2.D 42.91,47.03 42.91,47.42 45.58,50.09 47.36,50.09 U$8.P$2
N$26
  Top 0.406: R6.1 45.85,42.01 47.23,43.39 47.23,45.69 48.98,47.44 53.48,47.44 LED8.C
N$27
  Top 0.406: U$7.8 78.84,10 80.68,11.84 80.68,16.09 81.43,16.84 82.3,16.84 T3.C
N$28
  Top 0.406: T4.C 73.27,6.85 71.98,8.19 65.28,8.19 64.43,8.99 64.43,9.92 U$7.6
N$29
  Top 0.406: T5.C 47.34,6.85 49.18,8.69 53.83,8.69 54.38,9.24 54.38,9.97 U$7.2
N$30
  Top 0.406: T6.C 41.11,7.67 43.33,9.89 51.7,9.89 U$7.1
N$31
  Top 0.406: U$7.15 55.26,21.07 R18.2
N$32
  Top 0.406: C20.1 12.32,25.37 R41.2 12.69,27.65 C14.2 14.77,27.6 | 14.77,27.6 R40.1 | 14.77,27.6 17.22,27.6 17.48,27.34 U2.1
N$33
  Top 0.406: C19.2 12.19,29.86 R42.2 14.29,29.78 C14.1 17.29,29.35 17.48,29.54 U2.8
N$34
  Top 0.406: THERM0.2 4.33,30.89 7.98,27.24 10.38,27.24 R41.1
N$35
  Top 0.406: THERM0.1 3.79,33.43 7.98,29.24 9.83,29.24 R42.1
N$36
  Top 0.406: R36.1 45.91,4.78 T5.B
N$37
  Top 0.254: T6.B 38.58,6.33 38.58,9.14 39.35,9.91 R37.1
N$38
  Top 0.406: U2.5 19.76,30.62 20.48,31.34 SJ1.1
N$39  (via drill 0.6)
  Top 0.254: R43.2 35.62,18.43 v36.68,19.49 | v54.23,37.34 54.23,37.19 55.88,35.54 U1.98
  Top 0.406: R43.2 35.62,14.7 36.78,13.54 36.78,12.79 S3.A2
  Bottom 0.254: v36.68,19.49 40.58,19.49 45.48,24.39 49.23,24.39 49.98,25.14 55.23,25.14 55.93,25.84 55.93,28.09 55.28,28.74 54.73,28.74 51.93,31.54 51.93,33.89 54.23,36.19 v54.23,37.34
N$40
  Top 0.406: R20.2 62.64,6.88 62.03,7.49 62.03,9.94 U$7.5
N$41
  Top 0.406: U$7.13 59.91,20.64 62.48,20.64 63.68,21.84 70.58,21.84 71.36,22.22 R22.2
N$42
  Top 0.406: U$7.14 58.27,21.54 62.08,21.54 63.51,22.87 R24.2
N$43
  Top 0.406: R17.2 75.58,6.74 73.53,8.79 67.53,8.79 67.13,9.19 67.13,9.92 U$7.7
N$44
  Top 0.406: U$7.11 65.59,21.24 78.58,21.24 79.56,22.22 R19.2
N$45
  Top 0.406: 23.68,39.44 L1.1 23.48,38.34
  Top 0.61: U$4.8 23.68,39.44 | 23.48,38.34 D1.C
N$46  (via drill 0.6)
  Top 0.254: R44.2 39,25.06 v40.48,26.54 | v54.23,39.09 54.23,38.74 55.43,37.54 U1.94
  Top 0.406: S2.A2 38.67,24.86 R44.2
  Bottom 0.254: v40.48,26.54 43.93,26.54 45.43,25.04 49.08,25.04 49.78,25.74 54.93,25.74 55.38,26.19 55.38,27.94 55.08,28.24 54.38,28.24 51.33,31.29 51.33,34.14 53.68,36.49 53.68,36.69 53.43,36.94 53.43,37.69 54.35,38.62 54.35,38.97 v54.23,39.09
N$47
  Top 0.406: U$7.3 56.89,8.85 56.03,8.04 50.33,8.04 49.93,7.64 49.93,6.76 R21.2
N$48
  Top 0.406: U$7.16 50.05,20.16 R23.2
N$49
  Top 0.254: LED6.A 59.97,29.43 61.18,30.64 62.18,30.64 62.88,31.34 62.88,32.76 U1.9
N$50  (via drill 0.5, 0.6)
  Top 0.254: LED5.A 24.32,53.43 28.58,57.69 51.13,57.69 58.43,50.39 58.43,47.39 59.13,46.69 60.43,46.69 64.43,42.74 64.43,42.34 v64.53,42.24 | v64.18,37.54 62.43,35.89 62.43,32.81 U1.8
  Bottom 0.254: v64.53,42.24 64.58,38.29 v64.18,37.54
N$51  (via drill 0.6)
  Top 0.254: LED2.A 10.26,43.57 v13.33,46.64 | v65.18,36.91 65.33,37.59 64.23,38.69 64.18,38.69 61.93,36.34 61.88,32.8 U1.7
  Bottom 0.254: v13.33,46.64 15.68,46.64 20.43,51.39 20.43,52.89 23.73,54.34 53.18,54.34 58.58,50.49 60.03,50.49 61.58,48.94 61.58,46.29 62.53,45.34 63.18,45.34 68.01,40.53 67.96,37.29 67.18,36.99 65.63,37.04 65.23,36.69 v65.18,36.91
N$52  (via drill 0.6)
  Top 0.254: LED1.A 12.98,34.94 v14.98,36.94 | v60.98,34.89 61.4,34.47 U1.6
  Bottom 0.254: v14.98,36.94 15.43,36.94 35.33,17.04 39.88,17.04 42.93,13.99 49.78,13.99 50.24,14.35 52.94,14.35 53.43,14.94 55.23,14.94 56.33,13.84 58.13,13.84 61.03,16.26 68.33,16.28 69.78,18.19 69.78,18.69 69.73,18.74 70.63,18.74 71.53,19.64 71.53,21.29 69.88,22.94 69.88,28.64 71.58,30.34 71.58,30.84 70.53,31.89 69.13,31.89 67.83,30.64 67.88,27.69 65.93,25.74 65.38,25.74 63.58,27.54 63.58,32.29 v60.98,34.89
N$53
  Top 0.406: LED1.C 5.49,34.97 R46.2
N$54
  Top 0.406: LED2.C 5.44,43.6 R47.2
N$55
  Top 0.406: LED5.C 5.49,53.51 R48.2
N$56
  Top 0.254: LED6.C 58.03,27.13 R49.2
N$57  (via drill 0.5, 0.6)
  Top 0.18: 68.73,19.29 70.42,19.31
  Top 0.2: U1.95 58.17,37.03 58.38,37.49 58.43,39.19 v58.73,39.39 | v66.33,20.34 66.43,20.39 66.43,20.69 68.53,20.69 68.53,19.44 68.73,19.29 | 70.42,19.31 71.99,20.75 79.09,20.75 81.73,23.49
  Top 0.254: SW1.B 101.13,3.08 101.7,3.65 102.05,3.65 103,4.6 103,6 102.1,6.9 97.2,6.9 92.89,10.21 92.88,17.12 86.6,23.6 81.74,23.6 81.73,23.49
  Top 0.406: SW1.B 100.98,3.08 R52.2
  Bottom 0.2: v58.73,39.39 58.93,39.39 60.9,37.44 60.9,35.99 60.19,35.24 60.19,34.44 60.73,33.99 61.33,33.99 63.18,32.14 63.18,27.34 65.23,25.29 66.38,25.29 66.79,24.84 66.79,20.94 66.53,20.64 v66.33,20.34
N$58  (via drill 0.5, 0.6)
  Top 0.18: 68.53,18.94 70.65,18.95
  Top 0.2: U1.96 58.33,36.64 59.08,37.54 v59.18,37.99 | v65.83,19.29 66.43,19.64 68.08,19.64 68.13,19.54 68.13,19.29 68.53,18.94 | 70.65,18.95 72.13,20.36 79.33,20.39 82.03,23.09
  Top 0.254: R50.2 83.82,3.73 83.35,4.2 83.35,6.45 84.25,7.35 90.4,7.35 92.37,9.78 92.34,16.93 86.2,23.1 82.04,23.1 82.03,23.09
  Top 0.406: R50.2 88.71,3.73 SW1.A
  Bottom 0.2: v59.18,37.99 60.53,36.64 60.53,36.14 59.78,35.39 59.78,34.34 60.43,33.63 61.13,33.63 62.78,32.04 62.78,27.24 65.13,24.89 66.18,24.89 66.38,24.69 66.38,21.19 66.28,21.09 65.88,21.09 65.58,20.79 65.58,19.64 65.98,19.24 v65.83,19.29
N$59  (via drill 0.5, 0.6)
  Top 0.18: 68.33,18.59 70.93,18.6
  Top 0.2: U1.97 58.58,36.04 59.13,36.59 v59.18,36.59 | 68.33,18.59 67.68,19.19 66.88,19.19 66.23,18.59 65.56,18.59 65,19.1 63.47,19.1 v62.88,19.69 | 70.93,18.6 72.38,19.99 79.53,19.99
  Top 0.254: 79.53,19.99 82.23,22.66 84.73,22.66 R51.2
  Top 0.813: R51.2 88.02,18.92 SW1.P1
  Bottom 0.2: v59.18,36.59 59.38,36.39 59.26,34.2 60.21,33.25 60.95,33.22 62.35,31.9 62.38,27.09 65.68,23.79 65.68,21.94 64.98,21.24 63.73,21.24 63.33,20.84 63.33,20.69 62.88,20.24 v62.88,19.69
N$60  (via drill 0.6)
  Top 0.2: R53.1 93.49,25 U$5.8
  Top 0.254: U$5.8 94.89,26.59 95.6,27.3 95.6,45.65 90.75,50.5 88.7,50.5 v88.6,50.6 | v68.3,45.5 68.3,46.35 67.4,47.25 U1.58
  Bottom 0.254: v88.6,50.6 86.05,50.6 84.75,51.9 84.75,52.5 83.35,53.9 70.2,53.9 66.15,49.85 66.15,49.3 68.3,47.15 v68.3,45.5
PGC1
  Top 0.254: CPU.5 57.75,56.23 57.75,55.08 59.16,53.67 59.16,51.9 58.86,51.6 58.86,51.25 59.37,50.74 59.37,48.31 U1.74
PGD1
  Top 0.254: CPU.4 66.84,55.67 65.57,54.4 60.4,54.4 59.61,53.61 59.61,51.36 59.59,51.34 59.59,51.21 59.89,50.91 U1.73
RST_INT  (via drill 0.6)
  Top 0.2: U1.19 67.87,29.5 68.1,29.3 69.3,29.3 72.74,25.92 72.74,22.41 78.24,22.41 78.24,24.32 77.97,24.39 v77.81,24.77 | v79.2,26.82 79.39,26.03 83.97,26.03 85.53,24.48 87.12,24.46 88.11,24.48 90,22.75 90,22.02 97.89,22.02 98.7,21.31 U$5.4
  Bottom 0.2: v77.81,24.77 77.81,25.81 78.31,26.31 v79.2,26.82
RTC_INT
  Top 0.2: U$5.3 97.5,19.86 97.5,20.93 96.81,21.62 93.68,21.62 | U1.18 67.35,32.73 67.35,31.32 67.43,31.24 67.43,28.94 67.49,28.88 69.15,28.87 71.71,26.31 72.33,25.82 72.38,25.72 72.38,22.05 72.56,21.87 72.6,21.93 72.58,21.95 78.53,21.95 78.6,21.98 78.6,24.13 78.61,24.15 81.41,24.15 81.41,24.09 88,24.09 88.03,24.04 89.61,22.52 89.61,21.82 89.79,21.64 93.15,21.64 93.17,21.62 93.68,21.62 | R54.1 93.68,20.62 93.68,21.62
RTS  (via drill 0.6)
  Top 0.406: IC1.3 22.78,18.45 22.78,17.24 23.38,16.64 v23.38,14.44
  Bottom 0.406: 23.43,14.79 v23.38,14.44 23.33,8.04 26.41,4.96 FTDI.6
RX
  Top 0.2: FTDI.5 23.18,4.89 | 71.13,48.51 U1.51
  Top 0.305: FTDI.5 27.53,7.69 | 23.18,4.89 21.63,6.44 20.83,6.44 20.08,5.69 20.08,2.69 21.48,1.29 106.13,1.29 109.7,4.86 109.7,9.85 106.75,12.8 102.4,12.85 100.7,14.85 100.7,18 102.25,19.8 108.35,19.75 109.63,21.03 109.63,49.94 106.22,54.14 74.42,54.14 71.13,49.84 71.13,48.51
  Top 0.406: FTDI.5 | 27.53,7.69 27.53,12.14 26.03,13.49 21.98,13.49 21.03,14.09 21.03,16.64 21.54,17.14 IC1.5
SCK1  (via drill 0.5, 0.6)
  Top 0.254: CONN2.5 81.08,38.06 79.97,38.06 R11.1 | 81.17,38.04 CONN2.5 | U1.55 68.9,50.12 v68.76,50.33 | v84.05,38.1 CONN2.5
  Bottom 0.254: v68.76,50.33 68.78,50.94 71.08,52.84 78.68,52.84 83.93,48.09 83.93,47.54 84.63,46.84 85.58,46.84 86.08,46.34 86.08,37.22 85.45,36.59 85.45,34.57 86.35,33.67 86.35,32.79 85.54,31.98 84.91,31.98 84.05,32.84 v84.05,38.1
SD_PWR  (via drill 0.6)
  Top 0.18: 62.93,48.25 62.93,46.89 v63.18,46.64
  Top 0.254: U1.67 62.93,48.25 | v74.13,33.64 74.9,34.41 R16.1
  Bottom 0.254: v63.18,46.64 68.93,41.04 68.92,34.89 69.38,34.34 72.08,34.34 72.78,33.64 v74.13,33.64
SDI1  (via drill 0.6)
  Top 0.254: R10.1 81.03,33.26 CONN2.7 81.14,33.19 v85.38,33.19 | U1.54 69.4,49.41 70.13,50.14 70.13,50.64 v69.93,50.84
  Bottom 0.254: v69.93,50.84 70.08,51.44 71.23,52.34 78.33,52.34 83.38,47.79 83.38,47.24 84.53,46.09 85.28,46.09 85.48,45.89 85.48,37.39 84.88,36.79 84.88,33.69 v85.38,33.19
SDO1  (via drill 0.6)
  Top 0.254: R9.1 81.11,45.61 CONN2.2 81.17,45.54 84.18,45.54 v84.63,45.09 | U1.53 69.9,49.21 70.83,50.29 70.78,50.99 v71.38,51.49
  Bottom 0.254: v71.38,51.49 71.43,51.74 71.83,51.84 78.03,51.84 82.78,47.44 82.78,46.94 v84.63,45.09
T0  (via drill 0.5, 0.6)
  Top 0.305: SJ1.2 19.65,33.76 20.13,34.24 22.13,34.24 23.08,33.29 v23.23,33.29 | U1.22 69.4,31.87 v72.08,29.19 | v25.48,25.09 25.48,30.29 v25.13,30.64
  Top 0.406: U2.6 18.79,32.07 SJ1.2 | v29.37,16.86 29.26,16.75 v29.26,11.69
  Bottom 0.2: 29.43,21.14 29.38,21.09 | v29.38,4.58 29.43,5.14
  Bottom 0.305: v72.08,29.19 72.08,19.09 71.23,18.24 70.73,18.24 69.88,17.39 69.88,16.99 71.88,14.99 74.33,14.99 77.03,12.29 77.03,10.74 77.33,10.44 77.33,9.29 76.93,8.89 76.93,4.29 75.13,1.39 32.38,1.39 29.43,5.14 | 29.43,21.14 v25.48,25.09 | v25.13,30.64 25.13,31.39 v23.23,33.29
  Bottom 0.406: 29.38,21.09 29.34,21.05 29.34,16.99 29.37,16.96 v29.37,16.86 | v29.26,11.69 29.43,11.52 v29.38,4.58
T1  (via drill 0.6)
  Top 0.254: C11.1 11.83,39.16 11.83,37.79 12.28,37.34 13.43,37.34 14.13,38.04 v14.13,38.54 | v69.83,30.14 68.98,31.29 68.93,31.69 68.93,32.75 U1.21
  Top 0.406: R38.2 10.86,42.44 C11.1 2.7,40.13 THERM1.2
  Bottom 0.254: v14.13,38.54 14.78,38.54 15.33,37.99 15.33,37.94 35.58,17.69 40.03,17.69 43.18,14.54 46.53,14.54 47.93,15.94 50.13,15.94 51.28,14.79 52.68,14.79 53.33,15.44 56.03,15.44 56.78,14.69 58.08,14.69 60.48,16.74 67.98,16.74 69.08,18.29 69.08,18.99 69.28,19.19 70.33,19.19 70.88,19.74 70.88,20.94 69.28,22.54 69.28,29.54 v69.83,30.14
T2  (via drill 0.6)
  Top 0.254: C13.1 10.92,47.3 v10.98,47.24 | v68.63,30.09 68.4,31.42 U1.20
  Top 0.406: R39.2 10.92,51.43 C13.1 10.18,49.22 10.18,49.54 2.8,49.54 THERM2.2
  Bottom 0.254: v10.98,47.24 10.98,43.04 35.73,18.29 40.13,18.29 43.28,15.14 46.48,15.14 47.73,16.39 50.33,16.39 51.48,15.24 52.53,15.24 53.13,15.89 56.18,15.89 56.83,15.24 58.03,15.24 60.34,17.3 67.68,17.17 68.58,18.29 68.58,29.84 v68.63,30.09
TX  (via drill 0.6)
  Top 0.305: R5.1 26.4,14.17 28.18,12.54 27.98,2.79 28.88,1.89 105.88,1.89 109.03,5.04 109.03,9.57 106.5,12.1 102.15,12.1 100,14.55 100,18.25 101.95,20.4 108.15,20.4 109.05,21.3 109.05,49.81 108.87,49.99 | 109.03,49.79 108.87,49.99 | 108.87,49.99 105.97,53.55 75.21,53.55 v73.23,50.79 | v69.47,46.63 70.4,47.31 U1.52
  Top 0.406: FTDI.4 21.33,4.24 22.28,3.29 26.98,3.29 28.13,4.19 28.18,12.54 26.43,14.14 26.38,16 26.4,16.02 26.38,16.04 26.38,16.59 R5.1
  Bottom 0.305: v73.23,50.79 73.23,50.14 v69.47,46.63
VDD  (via drill 0.5, 0.6)
  Top 0.2: 86.1,19.35 R51.1 | R53.2 R45.2 91.19,23.11 v89.83,24.47 | R54.2 91.64,19.44 93.29,17.79 93.29,16.4 94.39,15.3 v94.9,15.3
  Top 0.254: C15.1 55.94,41.51 57.13,41.51 U1.86 58.59,41.53 59.33,40.79 62.33,40.79 63.8,39.32 | U$1.P$4 65.76,50.72 | 65.76,50.72 65.41,50.29 | 65.41,48.25 U1.62 65.39,48.25 | 65.76,50.72 65.86,51.47 | 59.38,34.74 59.28,34.69 | 30.18,33.24 29.78,33.44 | 72.03,47.79 72.03,47.39 68.58,43.94 68.38,43.94 | U1.16 66.4,37.37 | U1.30 70.54,36.53 69.7,37.37 66.4,37.37 | R11.2 76.11,39.86 76.13,39.84 76.13,41.09 76.03,41.29 | R7.2 66.98,25.99 v67.33,25.64 | R10.2 75.89,31.11 R12.2 | 75.43,25.29 v75.38,25.24 | R43.1 33.72,22.73 33.93,22.94 | C7.1 | 66.4,37.37 66.39,39.51 65.12,40.64 | 67.3,42.82 67.94,42.18 70.88,42.18 71.3,41.76 71.3,40.05 71.32,40.03 U1.37
  Top 0.3: R50.1 86.53,5.63 v87.04,6.14
  Top 0.305: U1.2 59.4,33.72 59.38,34.74
  Top 0.406: U$4.4 29.88,34.34 29.88,35.44 28.98,36.34 24.48,36.34 L1.2 22.93,36.29 C1.+ 18.58,34.56 C18.1 17.82,33.42 17.82,32 18.13,31.74 18.13,30.72 U2.7 18.14,29.59 18.13,29.59 18.33,29.39 C12.1 | 65.41,50.29 65.41,48.25 | 65.86,51.47 C7.1 | R13.2 76.19,48.06 R8.2 76.24,45.69 R9.2 76.32,44.54 | 76.32,44.54 75.92,43.45 C16.1 | 75.84,40.23 R11.2 | U1.46 76.31,44.53 76.32,44.54 | T9.E 53.42,21.78 53.03,21.39 53.03,18.24 | T7.E 61.28,23.34 60.58,24.14 59.58,24.14 59.13,24.84 v59.13,25.44 | v61.38,18.79 61.38,18.29 61.43,18.24 60.83,18.24 | T13.E 69.44,23.08 68.48,24.04 67.83,24.04 67.33,24.54 v67.33,25.64 | v67.23,17.89 67.28,17.99 | T10.E 77.5,23.22 76.64,24.46 75.89,24.46 75.33,24.64 75.33,25.19 v75.38,25.24 | v75.18,18.34 75.18,14.04 v77.88,11.34 | v77.88,8.69 77.88,7.21 T8.E | T11.E 64.88,7.14 63.23,8.79 63.23,17.14 61.33,18.14 | T14.E 52.89,5.84 53.43,5.84 53.88,5.39 v53.88,3.34 | v55.63,11.39 55.58,18.24 | R50.1 87.12,5.54 R52.1 | 68.38,43.94 65.39,46.89 65.39,48.25 | CPU.2 71.92,54.53 68.88,51.49 C7.1 | C3.1 89.83,25.24 v89.83,24.47
  Top 0.5: 59.28,34.69 57.93,33.24
  Top 0.61: C16.1 75.84,40.23 | 30.18,33.24 31.03,34.09 46.33,34.09 46.93,33.49 46.93,33.29 57.93,33.24 57.93,31.48 C17.1 | 76.03,41.29 80.52,41.29 CONN2.4 | R10.2 75.88,26.88 75.42,26.42 75.43,25.29
  Top 0.813: 60.83,18.24 55.58,18.24 53.03,18.24 49.83,18.24 47.53,20.54 45.83,20.54 45.22,21.15 T12.E 45.23,21.19 44.63,20.59 40.58,20.59 39,22.17 R44.1 38.86,22.49 36.58,22.49 36.13,22.94 33.93,22.94 25.63,22.94 23.48,25.09 23.48,31.09 24.58,32.19 29.13,32.19 29.78,32.84 29.78,33.44 U$4.4 | 61.43,18.24 61.33,18.14 61.98,17.44 66.23,17.54 67.23,17.54 | 67.23,17.54 68.13,17.54 68.18,17.59 74.43,17.59 v75.18,18.34 75.22,18.4 81.65,18.4 83.5,20.15 85.25,20.15 86.03,19.37 R51.1 | 67.23,17.54 v67.23,17.89 | 59.28,34.69 63.8,39.32 65.12,40.64 67.3,42.82 71.98,47.57 72.03,47.79 74.78,50.54 76.17,50.54 R13.2 | U$5.2 96.16,16.56 v94.9,15.3 | v88.1,15.3 87.3,15.3 86.1,16.5 86.1,19.35
  Bottom 0.2: v89.83,24.47 90.8,24.47 96.16,19.1 96.16,16.56 v94.9,15.3
  Bottom 0.3: v87.04,6.14 84.52,7.87 78.72,7.89 78.68,7.89 v77.88,8.69
  Bottom 0.406: v59.13,25.44 60.28,25.44 61.38,24.34 v61.38,18.79 | v67.33,25.64 67.23,18.64 v67.23,17.89 | v75.38,25.24 75.38,18.54 v75.18,18.34 | v77.88,11.34 v77.88,8.69 | v53.88,3.34 55.58,5.04 v55.63,11.39
  Bottom 0.813: v94.9,15.3 v88.1,15.3

## Text on the board
tNames: +24VDC | OUT2 | OUT1 | T2 | + | T1 | + | T0 | - | TX | RX | GND | CTS | 3V3 | RTS
tDocu: SET | SEL